# EasyEDA Pro project ProPrj_VFD_DynoClock_ESP32_2025-04-16.epro, board main board
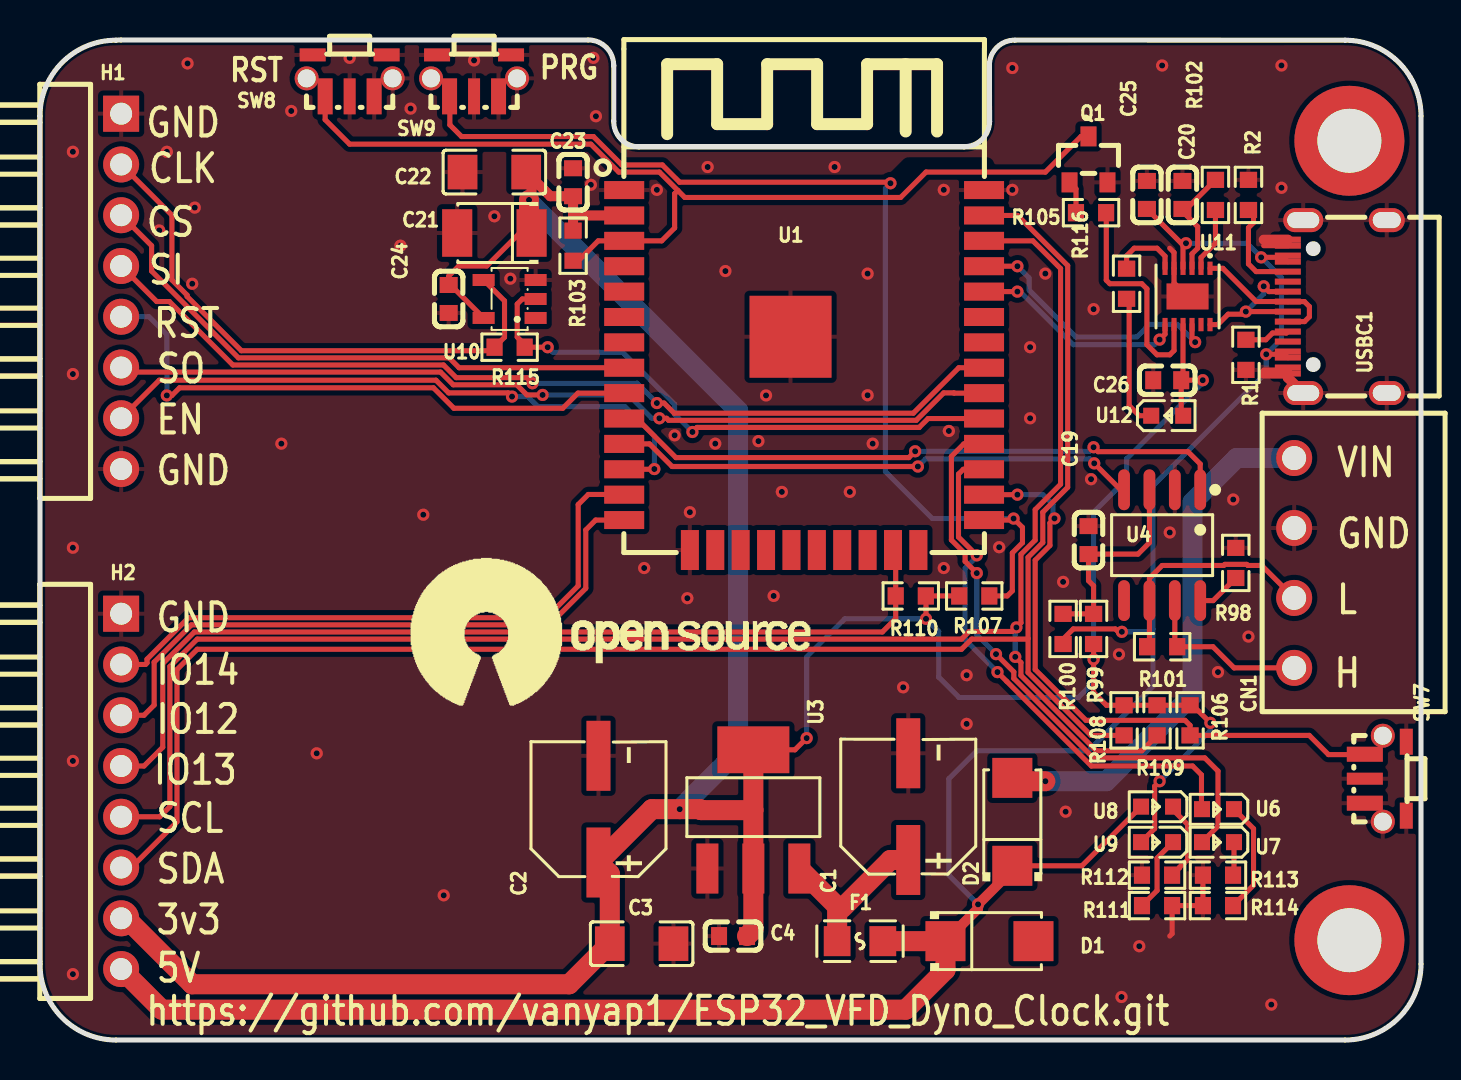
[diagram p4: board, top side]
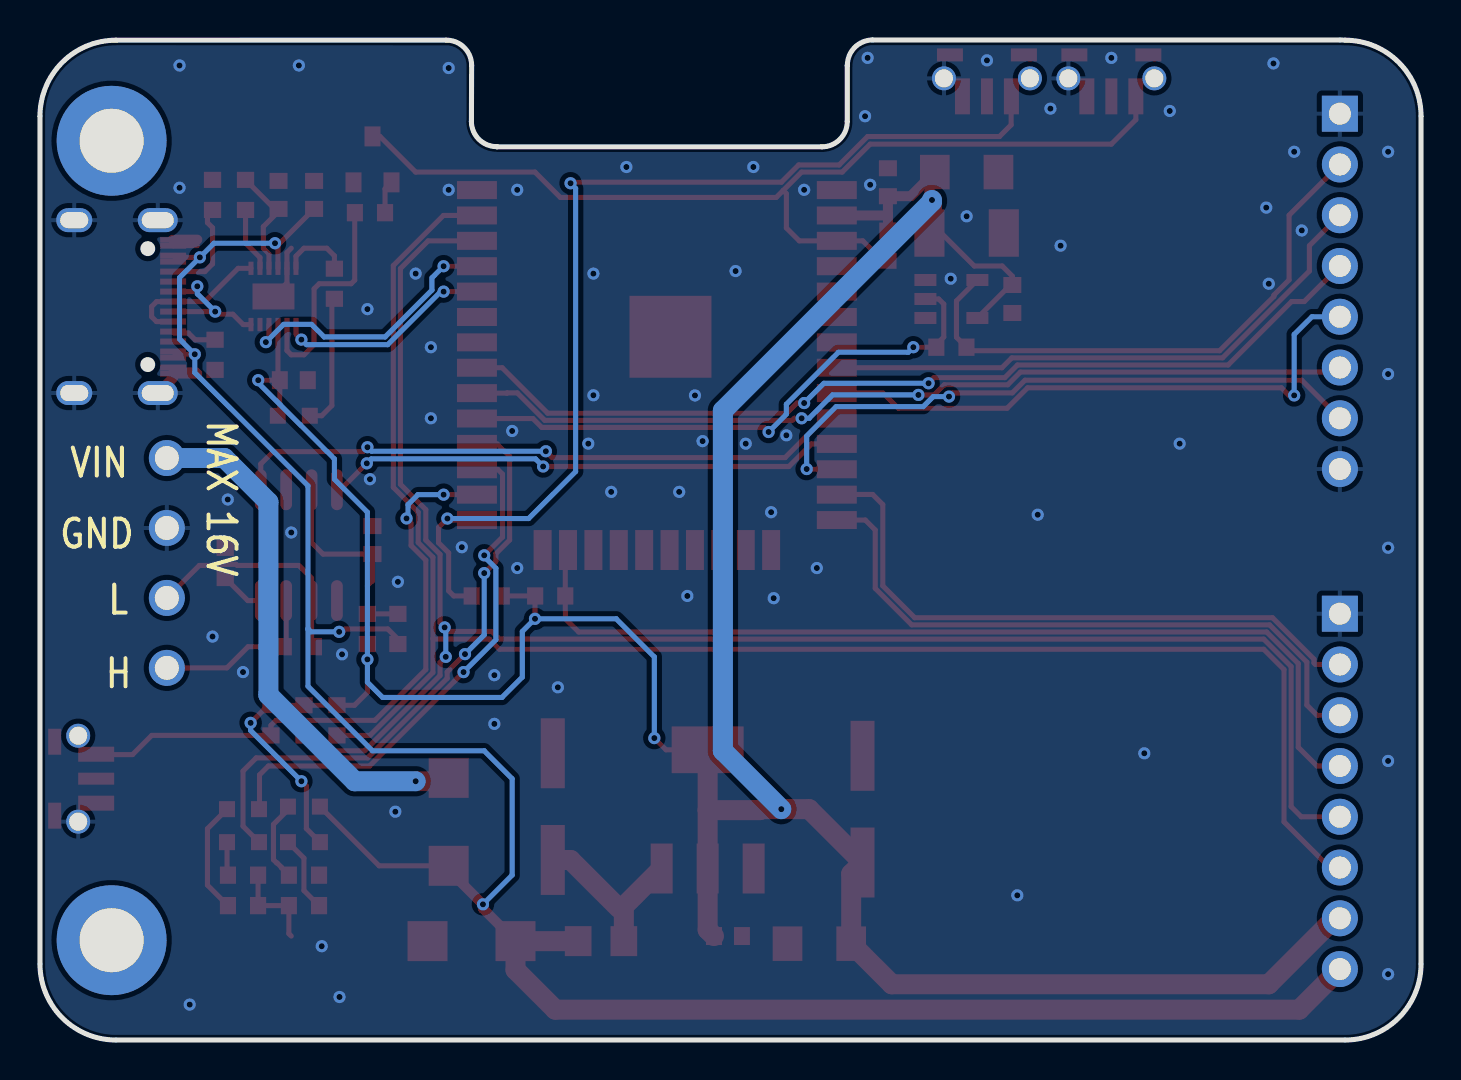
[diagram p5: board, bottom side, seen from below]

Outline 69.08 x 50.04 mm; copper layers: Top Layer, Bottom Layer. Coordinates in mm from the lower left corner of the outline.
Outline path: 0,46.23 arc(1.11,48.92) 3.8,50.03 4.05,50.04 27.43,50.04 arc(28.33,49.66) 28.69,48.76 28.7,48.75 28.7,45.98 arc(29.06,45.07) 29.96,44.69 46.22,44.69 46.22,44.7 arc(47.12,45.07) 47.5,45.97 47.49,48.77 arc(47.86,49.67) 48.77,50.03 65.28,50.03 arc(67.97,48.92) 69.08,46.23 69.08,3.8 arc(67.97,1.11) 65.28,0 3.8,0 arc(1.11,1.11) 0,3.8 0,46.23
Stack: Top Layer 0.035mm / Dielectric1 1.51mm FR4 er 4.5 / Bottom Layer 0.035mm

## Design rules (mm)
template: JLCPCB Capability(Two Layers Board)
spacing copperThickness1oz (default): track to track 0.102, other pairs 0.152 to 0.3
spacing copperThickness2oz: track to track 0.203, other pairs 0.152 to 0.3
track width copperThickness1oz (default): min 0.127, default 0.254, max 2.54
track width copperThickness2oz: min 0.203, default 0.254, max 2.54
differential pair differentialPair (default): width min 0.127, default 0.254, max 2.54; gap min 0.152, default 0.152
via viaSize (default): diameter min 0.5, default 0.61, max 10; hole min 0.3, default 0.305, max 6.3

## Placement (name value [footprint] x y rotation side)
C1  330uF  [CAP-SMD_BD6.3-L6.6-W6.6-LS7.4-FD]  43.43 11.68 90 top
C2  330uF  [CAP-SMD_BD6.3-L6.6-W6.6-LS7.4-FD]  27.94 11.55 90 top
C3  10uF  [C1206]  30.09 4.82 180 top
C4  100nF  [C0603]  34.67 5.2 0 top
C19  100nF  [C0603]  52.45 25.01 270 top
C20  100nF  [C0603]  57.15 42.29 270 top
C21  100uF  [CASE-B_3528]  22.73 40.38 180 top
C22  10uF  [C1206]  22.73 43.43 0 top
C23  100nF  [C0603]  26.66 42.92 270 top
C24  100nF  [C0603]  20.44 37.08 90 top
C25  100nF  [C0603]  55.37 42.29 270 top
C26  100nF  [C0603]  56.38 33.02 0 top
CN1  WJ15EDGRC-3.5-4P  [CONN-TH_4P-P3.50_WJ15EDGRC-3.5]  62.73 23.87 90 top
D1  SS34  [SMA_L4.3-W2.6-LS5.2-RD]  47.49 4.95 0 top
D2  SS34  [SMA_L4.3-W2.6-LS5.2-RD]  48.64 10.92 90 top
F1  0ZCK0020FF2G  [F0805]  41.02 4.95 180 top
H1  PZ254R-11-08P  [HDR-TH_8P-P2.54-H-M-W10.4]  4.06 37.46 270 top
H2  PZ254R-11-08P  [HDR-TH_8P-P2.54-H-M-W10.4]  4.06 12.44 270 top
NOREF  -  [Pad_e9]  65.5 45 0 top
NOREF#2  -  [Pad_e6]  65.5 5 0 top
Q1  MMBT2222A  [SOT-23_L2.9-W1.3-P1.90-LS2.4-BR]  52.45 44.06 270 top
R1  5.1kΩ  [R0603]  60.32 34.29 90 top
R2  5.1kΩ  [R0603]  60.45 42.29 90 top
R98  10kΩ  [R0603]  59.81 23.87 90 top
R99  0Ω  [R0603]  52.7 20.57 90 top
R100  0Ω  [R0603]  51.18 20.57 90 top
R101  120Ω  [R0603]  56.13 19.68 0 top
R102  10kΩ  [R0603]  58.8 42.29 270 top
R103  10kΩ  [R0603]  26.66 39.75 90 top
R105  10kΩ  [R0603]  52.57 41.4 180 top
R106  10kΩ  [R0603]  57.53 16 90 top
R107  10kΩ  [R0603]  46.73 22.22 180 top
R108  10kΩ  [R0603]  54.22 16 90 top
R109  10kΩ  [R0603]  55.88 16 90 top
R110  10kΩ  [R0603]  43.56 22.22 0 top
R111  680Ω  [R0603]  55.88 6.73 180 top
R112  680Ω  [R0603]  55.88 8.25 0 top
R113  680Ω  [R0603]  58.92 8.25 0 top
R114  680Ω  [R0603]  58.92 6.73 0 top
R115  0Ω  [R0603]  23.49 34.67 180 top
R116  680Ω  [R0603]  54.35 37.84 270 top
SW7  HX TS35CA-XL 250gf  [KEY-SMD_HX-TS35CA-250GF]  67.31 13.08 270 top
SW8  HX TS35CA-XL 250gf  [KEY-SMD_HX-TS35CA-250GF]  15.49 48.26 0 top
SW9  HX TS35CA-XL 250gf  [KEY-SMD_HX-TS35CA-250GF]  21.71 48.26 0 top
U1  ESP32-WROOM-32-N4  [WIFIM-SMD_ESP32-WROOM-32-N4]  38.22 33.52 0 top
U3  A1117-3.3  [SOT-223-3_L6.5-W3.4-P2.30-LS7.0-BR-1]  35.68 11.55 270 top
U4  SN65HVD230D  [SOIC-8_L4.9-W3.9-P1.27-LS6.0-BL]  56.13 24.76 180 top
U6  NCD0603Y5  [LED0603-RD]  58.92 11.55 180 top
U7  NCD0603Y5  [LED0603-RD]  58.92 9.9 180 top
U8  NCD0603Y5  [LED0603-RD]  55.88 11.68 180 top
U9  NCD0603Y5  [LED0603-RD]  55.88 9.9 180 top
U10  SN74LVC1G14DBVR  [SOT-23-5_L3.0-W1.7-P0.95-LS2.8-BR]  23.49 37.08 0 top
U11  FT234XD-R  [DFN-12_L3.0-W3.0-P0.45-BL-EP]  57.4 37.21 180 top
U12  NCD0603Y5  [LED0603-RD]  56.38 31.24 0 top
USBC1  TYPE-C-31-M-12  [USB-C_SMD-TYPE-C-31-M-12]  64.89 36.7 90 top

## Footprints (pads in the part's own frame, mm; a bottom-side part is the same pattern mirrored in y, then rotated)
C0603
  rect 0.8x0.9 smd: 1(-0.7,0) 2(0.7,0)
C1206
  rect 1.485x1.728 smd: 1(-1.593,0) 2(1.593,0)
CAP-SMD_BD6.3-L6.6-W6.6-LS7.4-FD
  rect 3.5x1.2 smd: 1(-2.67,0) 2(2.67,0)
CASE-B_3528
  rect 1.506x2.376 smd: 1(-1.861,0) 2(1.861,0)
CONN-TH_4P-P3.50_WJ15EDGRC-3.5
  round 1.8 hole 1.2: 1(-5.25,0) 2(-1.75,0) 3(1.75,0) 4(5.25,0)
DFN-12_L3.0-W3.0-P0.45-BL-EP
  rect 0.252x0.665 smd: 1(-1.125,-1.407) 2(-0.675,-1.407) 3(-0.225,-1.407) 4(0.225,-1.407) 5(0.675,-1.407) 6(1.125,-1.407) 7(1.125,1.407) 8(0.675,1.407) 9(0.225,1.407) 10(-0.225,1.407) 11(-0.675,1.407) 12(-1.125,1.407)
  rect 2.1x1.3 smd: 13(0,0)
F0805
  rect 1.335x1.5 smd: 1(-1.143,0) 2(1.143,0)
HDR-TH_8P-P2.54-H-M-W10.4
  rect 1.8x1.8 hole 1.1: 1(-8.89,0)
  round 1.8 hole 1.1: 2(-6.35,0) 3(-3.81,0) 4(-1.27,0) 5(1.27,0) 6(3.81,0) 7(6.35,0) 8(8.89,0)
KEY-SMD_HX-TS35CA-250GF
  round 1.2 hole 0.9: 1(-2.15,-0.138) 3(2.15,-0.138)
  rect 0.75x1.8 smd: 1(-1.225,-1.038) 3(1.225,-1.038)
  rect 0.6x1.8 smd: 2(0,-1.038)
  rect 1.3x0.65 smd: 4(-1.85,1.038) 4(1.85,1.038)
LED0603-RD
  rect 0.8x0.8 smd: 1(-0.799,0) 2(0.799,0)
Pad_e6
  round 5.5 hole 3.2: 1(0,0)
Pad_e9
  round 5.5 hole 3.2: 1(0,0)
R0603
  rect 0.806x0.864 smd: 1(-0.753,0) 2(0.753,0)
SMA_L4.3-W2.6-LS5.2-RD
  rect 2x2 smd: 1(-2.2,0) 2(2.2,0)
SOIC-8_L4.9-W3.9-P1.27-LS6.0-BL
  oval 0.588x2.045 smd: 1(-1.905,-2.772) 2(-0.635,-2.772) 3(0.635,-2.772) 4(1.905,-2.772) 5(1.905,2.772) 6(0.635,2.772) 7(-0.635,2.772) 8(-1.905,2.772)
SOT-23-5_L3.0-W1.7-P0.95-LS2.8-BR
  rect 1.1x0.6 smd: 1(1.3,-0.95) 2(1.3,0) 3(1.3,0.95) 4(-1.3,0.95) 5(-1.3,-0.95)
SOT-23_L2.9-W1.3-P1.90-LS2.4-BR
  rect 1x0.8 smd: 1(1.15,-0.95) 2(1.15,0.95) 3(-1.15,0)
SOT-223-3_L6.5-W3.4-P2.30-LS7.0-BR-1
  rect 2.5x1.1 smd: 1(2.97,-2.3) 2(2.97,0) 3(2.97,2.3)
  rect 2.34x3.6 smd: 2(-2.97,0)
USB-C_SMD-TYPE-C-31-M-12
  oval 1.2x2 hole 0.8x1.6: 0(-4.325,1.706) 1(4.325,1.706)
  oval 1.2x1.8 hole 0.8x1.4: 2(4.325,-2.474) 3(-4.325,-2.474)
  rect 0.3x1.3 smd: A1(-3.35,2.474) A4(-2.55,2.474) A5(-1.25,2.474) A6(-0.25,2.474) A7(0.25,2.474) A8(1.25,2.474) A9(2.55,2.474) A12(3.35,2.474) B1(3.05,2.474) B4(2.25,2.474) B5(1.75,2.474) B6(0.75,2.474) B7(-0.75,2.474) B8(-1.75,2.474) B9(-2.25,2.474) B12(-3.05,2.474)
WIFIM-SMD_ESP32-WROOM-32-N4
  rect 2x0.9 smd: 1(-9,9.005) 2(-9,7.735) 3(-9,6.465) 4(-9,5.195) 5(-9,3.925) 6(-9,2.655) 7(-9,1.385) 8(-9,0.115) 9(-9,-1.155) 10(-9,-2.425) 11(-9,-3.695) 12(-9,-4.965) 13(-9,-6.235) 14(-9,-7.505) 25(9,-7.505) 26(9,-6.235) 27(9,-4.965) 28(9,-3.695) 29(9,-2.425) 30(9,-1.155) 31(9,0.115) 32(9,1.385) 33(9,2.655) 34(9,3.925) 35(9,5.195) 36(9,6.465) 37(9,7.735) 38(9,9.005)
  rect 0.9x2 smd: 15(-5.715,-9.005) 16(-4.445,-9.005) 17(-3.175,-9.005) 18(-1.905,-9.005) 19(-0.635,-9.005) 20(0.635,-9.005) 21(1.905,-9.005) 22(3.175,-9.005) 23(4.445,-9.005) 24(5.715,-9.005)
  rect 4.1x4.1 smd: 39(-0.68,1.665)

## Nets
As in the schematic.

Pads without a net: NOREF 1; NOREF#2 1; U1 4 5 6 7 16 17 18 19 20 21 22 24 32 33; U4 5; U10 1; U11 11; USBC1 A8 B8

## Via types
v1: diameter 0.61, hole 0.305, Top Layer to Bottom Layer, 111 vias

## Routing (per net, layer and track width the routed paths; a pad name or vN(x,y) marks a point on that pad's centre or on a via; arc(x,y) is an arc through that point)
GND: length 13.6
  Top Layer w0.254: 56.51,39.62 56.72,39.41 U11.5 56.72,37.88 U11.13 ; 62.93,32.63 USBC1.0 ; 56.51,5.2 56.63,5.32 R111.1 R114.1 R113.1 ; 61.21,39.75 62.42,39.75 USBC1.B1 ; 61.21,33.52 62.29,33.52 USBC1.B12
  Top Layer w0.5: 62.93,32.63 62.42,33.14 62.42,33.35 61.21,33.35 ; USBC1.A12 61.21,40.05
  vias: v1(1.65,44.45) v1(1.65,33.32) v1(1.65,24.63) v1(1.65,13.97) v1(1.65,3.3) v1(5.96,40.51) v1(6.34,44.45) v1(7.38,48.87) v1(7.62,37.84) v1(7.74,41.65) v1(12.07,29.84) v1(12.57,46.49) v1(13.84,14.35) v1(15.49,49.14) v1(18.03,39.75) v1(18.54,46.6) v1(19.17,26.28) v1(20.19,7.24) v1(21.71,49.02) v1(22.73,41.22) v1(23.53,38.09) v1(27.55,42.79) v1(27.68,49.14) v1(27.81,46.22) v1(30.22,23.62) v1(30.86,42.54) v1(31.75,30.26) v1(32.38,22.11) v1(32.51,26.41) v1(33.4,43.68) v1(33.78,29.84) v1(34.28,38.48) v1(35.94,29.97) v1(36.32,32.25) v1(36.7,22.22) v1(37.11,27.43) v1(39.75,43.68) v1(40.51,27.43) v1(41.4,38.35) v1(41.4,32.26) v1(41.65,29.84) v1(43.18,17.65) v1(45.21,42.54) v1(45.21,23.62) v1(45.46,30.48) v1(46.35,18.26) v1(46.35,15.82) v1(47.98,24.66) v1(48.64,48.64) v1(48.64,42.54) v1(49.53,34.67) v1(49.53,31.11) v1(50.29,38.35) v1(51.18,22.92) v1(51.3,11.43) v1(52.57,28.06) v1(52.7,36.57) v1(53.97,19.3) v1(54.1,2.15) v1(54.99,4.69) v1(56.13,48.76) v1(56.51,25.4) v1(58.92,18.41) v1(59.69,27.05) v1(60.45,20.19) v1(61.59,1.77) v1(62.1,48.76) v1(62.1,42.64)
VCC3V3: length 170.8
  Top Layer w0.254: C21.1 24,40.38 22.35,38.73 20.95,38.73 20.44,38.22 C24.2 20.54,37.78 U10.5 ; 44.32,22.22 R107.2 ; 44.32,22.22 v1(44.32,21.08) ; 44.32,22.22 R110.2 ; v1(58.54,15.87) 57.66,16.75 R106.2 R109.2 R108.2 53.34,16.75 52.7,17.39 v1(52.7,19.05) R99.1 ; v1(38.35,15.11) 37.76,14.52 U3.2 ; C26.2 57.17,33.11 U11.9 ; C26.2 57.08,31.34 U12.2 ; C26.2 v1(58.16,33.02) ; U9.2 55.75,10.58 55.75,12.7 v1(56,12.95)
  Top Layer w0.5: U1.2 26.71,41.26 26.66,41.3 ; 26.66,41.3 R103.2 ; 26.66,41.3 C23.2 25.53,42.22 24.59,43.16 ; 24.59,43.16 C22.2 ; 24.59,43.16 24.59,42.03
  Top Layer w1: v1(24.46,42.03) 24.46,40.51 C21.1 ; 35.68,11.5 U3.2 35.68,5.52 35.37,5.2 ; 35.68,11.5 U3.2 ; 35.68,11.5 33.06,11.5 33.02,11.55 v1(32,11.55) 30.61,11.55 C2.1 28.5,8.32 C3.2 26.47,2.79 7.62,2.79 4.31,6.09 H2.7
  Bottom Layer w0.254: v1(56,12.95) 58.54,15.49 v1(58.54,15.87) ; v1(38.35,15.11) 38.35,19.17 40.25,21.08 v1(44.32,21.08) 44.95,20.44 44.95,18.16 45.97,17.14 51.94,17.14 52.7,17.9 v1(52.7,19.05) 52.7,26.41 54.35,28.06 54.35,29.08 58.16,32.89 v1(58.16,33.02)
  Bottom Layer w1: v1(24.46,42.03) 24.46,41.95 34.92,31.49 34.92,14.47 v1(32,11.55)
VCC5V: length 119.5
  Top Layer w0.254: USBC1.B4 62.2,39.16 v1(61.08,39.16) ; v1(61.34,34.31) 62.25,34.31 USBC1.A4 ; C25.2 57.09,39.87 v1(57.32,39.87) 57.17,39.72 U11.4 ; v1(54.11,20.43) 53.93,20.43 53.79,20.57 51.68,20.57 51.18,20.06 R100.1 ; D2.1 52.11,8.72 U8.2
  Top Layer w0.5: D2.1 48.64,8.5 v1(46.92,6.79) 46.92,6.58 D1.1
  Top Layer w1: F1.1 D1.1 45.29,3.51 43.3,1.52 6.09,1.52 H2.8
  Bottom Layer w0.254: v1(46.92,6.79) 45.46,8.25 45.46,13.08 46.86,14.47 52.45,14.47 55.67,17.7 55.67,20.57 ; 55.67,20.57 55.67,27.73 61.34,33.4 v1(61.34,34.31) 62.1,35.08 62.1,38.15 v1(61.08,39.16) 60.38,39.87 v1(57.32,39.87) ; 55.67,20.57 55.53,20.43 v1(54.11,20.43)
VIN1: length 26.2
  Top Layer w1: v1(50.29,12.95) 48.93,12.95 48.89,12.99
  Bottom Layer w1: CN1.4 59.86,29.12 57.65,26.92 57.65,17.27 53.34,12.95 v1(50.29,12.95)
CAN_RX: length 26.3
  Top Layer w0.254: v1(43.91,28.7) 31.62,28.7 30.49,29.83 29.22,29.83 ; U4.4 54.05,27.53 v1(52.73,28.86)
  Bottom Layer w0.254: v1(43.91,28.7) 44.29,29.08 52.51,29.08 v1(52.73,28.86)
CAN_TX: length 31.5
  Top Layer w0.254: U1.10 29.85,31.1 31.81,29.14 43.46,29.14 v1(43.78,29.46) ; U4.1 58.03,28.82 57.42,29.44 52.92,29.44 v1(52.7,29.66)
  Bottom Layer w0.254: v1(43.78,29.46) 52.5,29.46 v1(52.7,29.66)
CC1: length 2.3
  Top Layer w0.254: R1.2 61.31,35.04 61.65,35.38 62.35,35.38 USBC1.A5
CC2: length 4.9
  Top Layer w0.254: 60.7,41.53 60.7,40.9 60.45,40.64 60.45,38.83 60.83,38.45 USBC1.B5
CS: length 29.1
  Top Layer w0.254: U1.8 20.96,33.64 20.47,34.13 9.93,34.13 5.58,38.48 5.58,39.75 H1.3
DN: length 7.4
  Top Layer w0.254: U11.1 59.17,38.61 60.83,36.95 62.41,36.95 USBC1.A7 63.25,36.95 63.5,36.7 63.5,36.19 63.25,35.95 USBC1.B7
DP: length 7.1
  Top Layer w0.254: v1(61.21,37.71) 61.47,37.45 USBC1.B6 ; USBC1.A6 v1(60.32,36.45) 60.19,36.32 59.43,36.32 58.91,35.8 U11.12
  Bottom Layer w0.254: v1(60.32,36.45) 61.21,37.34 v1(61.21,37.71)
EXT3: length 32.2
  Top Layer w0.254: H2.3 5.2,16.25 5.71,16.76 5.71,18.91 7.57,20.77 25.47,20.77 27.3,22.6 27.3,25.52 27.8,26.02 U1.14
EXT4: length 31.2
  Top Layer w0.254: U1.13 29.21,27.3 27.43,27.3 26.92,26.79 26.92,22.73 25.32,21.13 7.43,21.13 5.35,19.06 5.35,18.87 5.28,18.79 H2.2
HTTP: length 26.6
  Top Layer w0.254: v1(47.89,18.41) 48.36,17.95 52.59,13.71 57.65,13.71 58.1,13.27 58.1,11.58 U6.2 ; U1.27 46.19,28.56 45.94,28.32 45.94,25.17 v1(46.86,24.25)
  Bottom Layer w0.254: v1(47.89,18.41) 46.27,20.03 46.27,23.61 46.86,24.19 v1(46.86,24.25)
INT: length 47.7
  Top Layer w0.254: H2.4 5.2,13.71 6.14,14.65 6.14,18.84 7.72,20.42 42.13,20.42 42.8,21.09 R110.1 42.8,24.38 U1.23
IO0: length 53.7
  Top Layer w0.254: 42.59,42.92 31.99,42.92 31.13,43.79 29.1,43.79 27.68,45.21 21.09,45.21 20.5,45.79 20.5,47.2 SW9.1 ; 42.59,42.92 v1(42.54,42.87) 42.62,42.87 42.67,42.92 42.59,42.92 ; R107.1 48.38,22.22 48.64,22.47 48.64,24.37 49.14,24.88 49.14,25.65 v1(48.7,26.09) 48.62,26.02 U1.25
  Bottom Layer w0.254: v1(42.54,42.87) 42.29,42.62 42.29,28.44 44.64,26.09 v1(48.7,26.09)
MISO: length 44.8
  Top Layer w0.254: U1.30 45.73,32.37 45.72,32.38 45.2,32.38 43.83,31.01 31.44,31.01 31.34,31.11 v1(30.98,31.11) ; v1(25.14,32.28) 24.35,32.28 23.85,32.79 20.67,32.79 20.04,33.42 4.29,33.42 H1.6
  Bottom Layer w0.254: v1(25.14,32.28) 29.43,32.28 30.6,31.11 v1(30.98,31.11)
MOSI: length 47.2
  Top Layer w0.254: v1(30.86,31.87) 31.22,31.87 31.72,31.36 43.68,31.36 45.96,33.64 U1.31 ; v1(24.63,32.86) 24.35,33.14 20.82,33.14 20.18,33.78 9.65,33.78 6.47,36.95 5.84,36.95 H1.4
  Bottom Layer w0.254: v1(30.86,31.87) 29.87,32.86 v1(24.63,32.86)
RESET: length 49.9
  Top Layer w0.254: R103.1 26.93,38.99 27.92,39.99 31.1,39.99 31.75,40.64 31.75,42.35 31.9,42.51 ; 31.9,42.51 30.98,43.43 28.95,43.43 27.55,44.83 15.49,44.83 14.26,46.05 SW8.1 ; 31.9,42.51 32.25,42.16 43.05,42.16 44.32,43.43 50.29,43.43 52.07,45.21 Q1.3
RST: length 29.5
  Top Layer w0.254: U1.9 26.91,32.37 26.15,31.61 20.7,31.61 19.68,32.63 6.98,32.63 6.6,32.25 v1(6.34,32.25)
  Bottom Layer w0.254: H1.5 5.46,36.19 6.34,35.3 v1(6.34,32.25)
RTS: length 11.3
  Top Layer w0.254: R105.1 53.34,41.39 53.34,38.02 53.51,37.84 55.11,37.84 55.37,37.59 55.37,34.79 55.88,34.29 56.51,34.29 56.72,34.5 U11.8
RX0: length 10.8
  Top Layer w0.254: U11.7 56.27,35.32 v1(56,35.05) ; U1.34 v1(48.89,37.45)
  Bottom Layer w0.254: v1(56,35.05) 55.75,34.79 51.68,34.79 49.03,37.45 v1(48.89,37.45)
RXTXLED: length 3.5
  Top Layer w0.254: U11.6 56.27,39.22 55.88,39.62 54.73,39.62 54.35,39.24 R116.1
SCK: length 28.6
  Top Layer w0.254: v1(32.63,30.42) 32.86,30.65 43.98,30.65 44.42,31.1 U1.29 ; v1(25.4,34.67) R115.1 24.24,34.8 23.87,35.17 23.87,36.83 24.12,37.08 U10.2
  Bottom Layer w0.254: v1(32.63,30.42) 31.75,31.31 31.75,31.81 29.14,34.41 25.65,34.41 v1(25.4,34.67)
SCL: length 87.3
  Top Layer w0.254: 47.22,39.99 49.66,39.99 51.05,38.6 51.05,27.81 49.78,26.54 49.78,25.01 49.07,24.3 49.07,20.87 v1(48.84,20.65) 48.64,20.44 46.48,20.44 46.1,20.06 7.87,20.06 6.5,18.69 6.5,11.68 5.99,11.17 H2.5 ; v1(48.78,19.17) 49.07,18.89 49.07,18.24 52.84,14.47 55.11,14.47 55.88,15.23 R109.1
  Bottom Layer w0.254: v1(48.78,19.17) 48.78,20.59 v1(48.84,20.65)
SDA: length 87.1
  Top Layer w0.254: R108.1 52.57,15.24 49.42,18.39 49.42,20.09 ; H2.6 4.57,8.63 6.85,10.92 6.85,18.54 7.87,19.55 46.09,19.55 46.6,20.06 49.4,20.06 49.42,20.09 ; 49.42,20.09 49.42,24.15 50.16,24.89 50.16,26.41 51.41,27.66 51.41,38.75 48.9,41.26 U1.37
TX0: length 14
  Top Layer w0.254: U1.35 v1(48.89,38.72) ; v1(57.78,34.92) 57.62,35.08 U11.10
  Bottom Layer w0.254: v1(57.78,34.92) 56.89,35.81 55.49,35.81 54.86,35.18 51.82,35.18 49.47,37.52 49.47,38.13 v1(48.89,38.72)
USER_BTN: length 30.9
  Top Layer w0.254: SW7.1 66.25,14.28 64.45,14.28 63.49,15.24 R106.1 57.53,15.74 57.27,16 52.32,16 49.78,18.54 49.78,24.01 50.52,24.74 50.52,25.87 v1(50.74,26.1) ; U1.26 v1(48.89,27.29)
  Bottom Layer w0.254: v1(48.89,27.29) 50.17,27.29 50.67,26.79 50.67,26.18 v1(50.74,26.1)
VFD_EN: length 31.8
  Top Layer w0.254: U1.12 30.72,28.56 v1(30.73,28.57) ; H1.7 5.96,33.02 19.81,33.02 20.44,32.38 23.43,32.38 v1(23.61,32.2)
  Bottom Layer w0.254: v1(23.61,32.2) 24.4,32.2 24.9,31.69 29.26,31.69 30.73,30.22 v1(30.73,28.57)
WIFI: length 30.3
  Top Layer w0.254: U7.2 58.92,10.7 58.92,13.46 58.26,14.12 52.69,14.12 48.71,18.09 48.71,18.42 v1(47.82,19.31) ; 47.22,29.83 46.21,29.83 45.59,29.2 45.59,25.02 46.27,24.33 46.27,23.95 v1(46.86,23.36)
  Bottom Layer w0.254: v1(47.82,19.31) 46.86,20.27 v1(46.86,23.36)
$1N1609: length 8.7
  Top Layer w1: 40.13,6.6 42.54,9.01 C1.1 ; U3.3 39.87,6.69 F1.2
$1N3246: length 2.2
  Top Layer w0.254: U4.8 58.68,21.99 R98.1
$1N3386: length 10.6
  Top Layer w0.254: U4.3 55.49,24.89 54.92,24.31 C19.2 52.45,22.98 52.7,22.73 R99.2 R100.2
$1N3572: length 8.6
  Top Layer w0.254: U4.7 56.76,19.8 R101.2 58.67,19.68 59.73,18.62 CN1.1
$1N3578: length 11.7
  Top Layer w0.254: CN1.2 61.11,23.74 60.42,23.74 60.36,23.8 59.26,23.8 59.21,23.74 56.13,23.74 55.49,23.11 U4.6 55.49,19.8 R101.1
$1N4796: length 1.7
  Top Layer w0.254: R105.2 51.82,42.59 Q1.1
$1N6694: length 28.6
  Top Layer w0.254: U10.4 23.24,36.98 23.24,35.17 R115.2 22.56,34.49 10.07,34.49 7.36,37.2 7.36,37.27 6.6,38.03 6.6,41.27 H1.2
$1N7635: length 3.8
  Top Layer w0.254: U9.1 55.88,9.1 55.88,7.48 R111.2
$1N7639: length 4.1
  Top Layer w0.254: U8.1 56.67,11.51 57.4,10.79 57.4,9.02 57.24,8.86 57.21,8.86 57.01,8.65 57.01,8.63 R112.2
$1N7644: length 1.7
  Top Layer w0.254: R113.2 59.72,8.3 U7.1
$1N7649: length 5.7
  Top Layer w0.254: R114.2 60.7,7.75 60.7,10.57 U6.1
$1N10105: length 5.8
  Top Layer w0.254: R102.1 57.34,41.59 57.02,41.59 57.91,40.7 57.91,39.62 57.62,39.34 U11.3
$1N10113: length 3.2
  Top Layer w0.254: U11.2 58.07,39.15 58.8,39.87 R102.2
$1N10444: length 6.7
  Top Layer w0.254: U12.1 54.99,31.24 54.48,31.75 54.48,36.96 R116.2

## Copper pours and planes (outline as drawn; the poured copper is in the pictures)
GND on Top Layer: -0.13,50.16 69.21,50.16 69.21,-0.13 -0.13,-0.13
GND on Bottom Layer: 0.12,50.16 69.21,50.16 69.21,-0.13 0.12,-0.13

## Text on the board
Bottom Silkscreen Layer: L | H | VIN | GND | MAX 16V
Top Silkscreen Layer: RST | PRG | GND | https://github.com/vanyap1/ESP32_VFD_Dyno_Clock.git | CS | CLK | SI | IO13 | EN | IO14 | IO12 | SCL | SDA | 3v3 | 5V | SO | H | VIN | L
